# Altium schematic sheet SRF05.SchDoc
size B
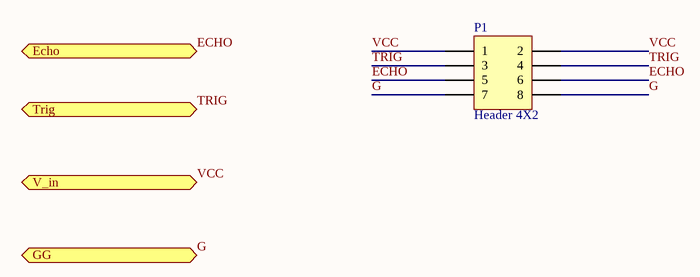
[diagram p0: SRF05.SchDoc]

## Parts
P1  Header 4X2  [HDR2X4]

## Ports
Echo (bidir), GG (bidir), Trig (bidir), V_in (bidir)

## Nets
ECHO: P1.5 P1.6 ; port Echo
G: P1.7 P1.8 ; port GG
TRIG: P1.3 P1.4 ; port Trig
VCC: P1.1 P1.2 ; port V_in

## Library data of the parts
P1 = Header 4X2: Header, 4-Pin, Dual row; LatestRevisionDate: 17-Jul-2002; LatestRevisionNote: Re-released for DXP Platform.; Publisher: Altium Limited